# EasyEDA Pro project ProPrj_Hitboard Pro v2.4 顶部 typec_2026-01-22.epro

# Board PCB1
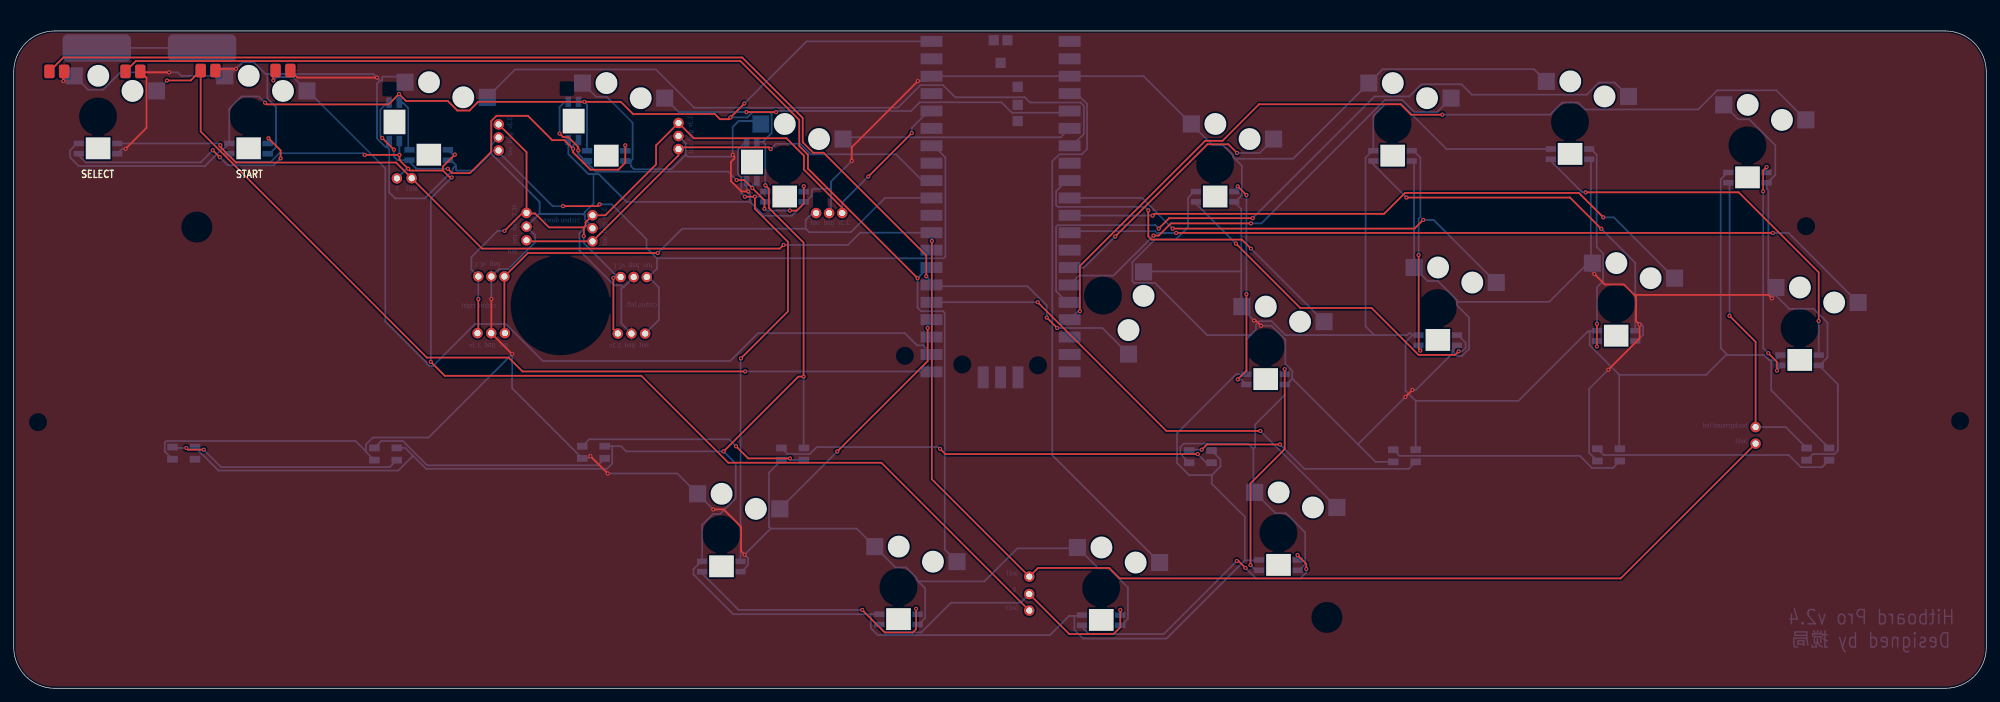
[diagram p0: board, top side]
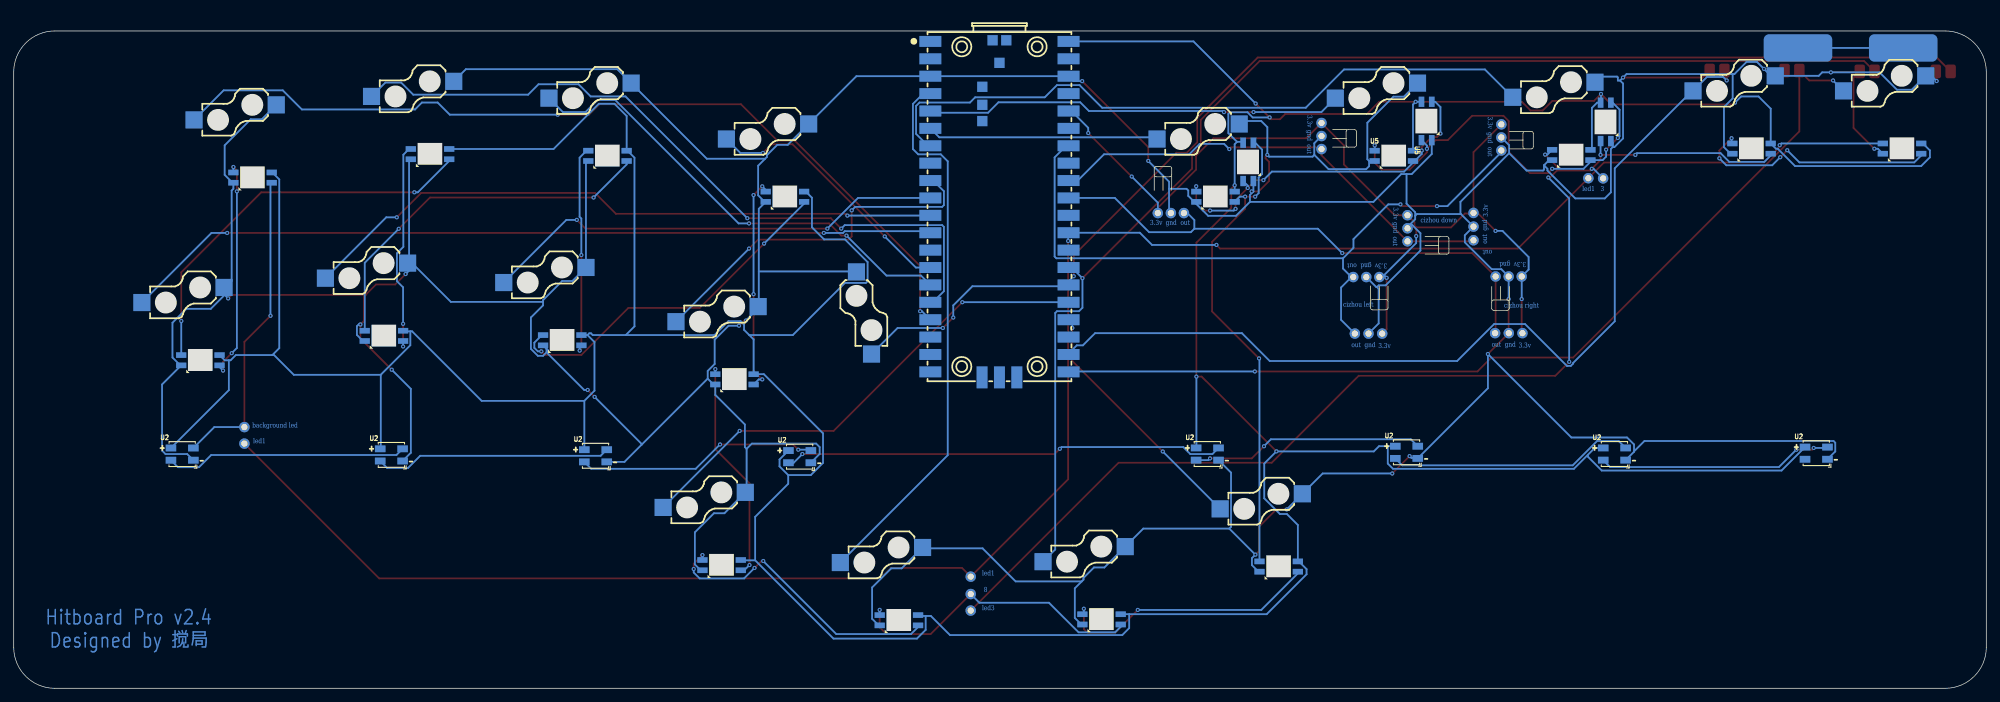
[diagram p1: board, bottom side, seen from below]

Outline 288 x 96 mm; copper layers: Top Layer, Bottom Layer. Coordinates in mm from the lower left corner of the outline.
Outline path: 0,90 arc(1.76,94.24) 6,96 282,96 arc(286.24,94.24) 288,90 288,6 arc(286.24,1.76) 282,0 6,0 arc(1.76,1.76) 0,6 0,90
Stack: Top Layer 0.035mm / Dielectric1 1.51mm FR4 er 4.5 / Bottom Layer 0.035mm

## Design rules (mm)
template: JLCPCB Capability(Two Layers Board)
spacing copperThickness1oz (default): track to track 0.102, other pairs 0.152 to 0.3
spacing copperThickness2oz: track to track 0.203, other pairs 0.152 to 0.3
track width copperThickness1oz (default): min 0.127, default 0.254, max 2.54
track width copperThickness2oz: min 0.203, default 0.254, max 2.54
differential pair differentialPair (default): width min 0.127, default 0.254, max 2.54; gap min 0.152, default 0.152
via viaSize (default): diameter min 0.5, default 0.61, max 10; hole min 0.3, default 0.305, max 6.3

## Placement (name value [footprint] x y rotation side)
NOREF  -  [Pad_e82]  40.39 90.22 0 top
NOREF#2  -  [Pad_e83]  38.23 90.22 0 top
NOREF#3  -  [Pad_e72]  92.43 60.06 180 top
NOREF#4  -  [Pad_e1079]  120.96 69.4 0 top
NOREF#5  -  [Pad_e8275]  148.27 13.77 90 top
NOREF#6  -  [Pad_e123]  70.8 78.55 90 top
NOREF#7  -  [Pad_e81]  27.3 90.22 0 top
NOREF#8  -  [Pad_e7355]  67.72 51.87 0 top
NOREF#9  -  [Pad_e80]  29.46 90.22 0 top
NOREF#10  -  [Pad_e8272]  55.94 74.47 90 top
NOREF#11  -  [Pad_e1081]  117.15 69.4 0 top
NOREF#12  -  [Pad_e56]  7.37 90.09 0 top
NOREF#13  -  [Pad_e117]  97.06 78.75 90 top
NOREF#14  -  [Pad_e8795]  254.32 35.74 90 top
NOREF#15  -  [Pad_e32726]  148.27 16.31 90 top
NOREF#16  -  [Pad_e17942]  148.27 11.35 90 top
NOREF#17  -  [Pad_e24566]  58.1 74.5 90 top
NOREF#18  -  [Pad_e73]  90.52 60.06 180 top
NOREF#19  -  [Pad_e66]  84.51 69.09 90 top
NOREF#20  -  [Pad_e115]  97.06 82.56 90 top
NOREF#21  -  [Pad_e7348]  92.19 51.81 0 top
NOREF#22  -  [Pad_e79]  71.64 60.14 180 top
NOREF#23  -  [Pad_e8276]  254.32 38.15 90 top
NOREF#24  -  [Pad_e71]  88.62 60.06 180 top
NOREF#25  -  [Pad_e121]  70.8 82.36 90 top
NOREF#26  -  [Pad_e7361]  74.87 69.42 270 top
NOREF#27  -  [Pad_e7353]  69.72 51.87 0 top
NOREF#28  -  [Pad_e7360]  74.87 65.43 270 top
NOREF#29  -  [Pad_e77]  67.83 60.14 180 top
NOREF#30  -  [Pad_e44]  16.32 90.09 0 top
NOREF#31  -  [Pad_e65]  84.51 67.18 90 top
NOREF#32  -  [Pad_e64]  84.51 65.28 90 top
NOREF#33  -  [Pad_e16564]  12.13 93.52 0 top
NOREF#34  -  [Pad_e122]  70.8 80.45 90 top
NOREF#35  -  [Pad_e7354]  71.71 51.87 0 top
NOREF#36  -  [Pad_e7349]  88.2 51.81 0 top
NOREF#37  -  [Pad_e47]  18.48 90.09 0 top
NOREF#38  -  [Pad_e1080]  119.05 69.4 0 top
NOREF#39  -  [Pad_e7359]  74.87 67.43 270 top
NOREF#40  -  [Pad_e16566]  27.5 93.52 0 top
NOREF#41  -  [Pad_e116]  97.06 80.66 90 top
NOREF#42  -  [Pad_e78]  69.74 60.14 180 top
NOREF#43  -  [Pad_e67]  5.21 90.09 0 top
NOREF#44  -  [Pad_e7347]  90.2 51.81 0 top
U1  PICO  [COMM-SMD_L51.0-W21.0-P2.54_SC0916]  144.08 70.03 270 bottom
U2  -  [LED-SMD_4P-L3.5-W3.5-TL_WS2812B]  203.05 33.96 180 bottom
U2#2  -  [LED-SMD_4P-L3.5-W3.5-TL_WS2812B]  232.86 34.09 180 bottom
U2#3  -  [LED-SMD_4P-L3.5-W3.5-TL_WS2812B]  173.25 33.83 180 bottom
U2#4  -  [LED-SMD_4P-L3.5-W3.5-TL_WS2812B]  113.73 34.21 180 bottom
U2#5  -  [LED-SMD_4P-L3.5-W3.5-TL_WS2812B]  84.65 34.47 180 bottom
U2#6  -  [LED-SMD_4P-L3.5-W3.5-TL_WS2812B]  54.29 34.21 180 bottom
U2#7  -  [LED-SMD_4P-L3.5-W3.5-TL_WS2812B]  24.83 34.34 180 bottom
U2#8  -  [LED-SMD_4P-L3.5-W3.5-TL_WS2812B]  263.41 34.2 180 bottom
U5  -  [LED-SMD_L3.2-W2.8_YO-WS2812B-3528]  60.59 77.89 180 bottom
U5#2  -  [LED-SMD_L3.2-W2.8_YO-WS2812B-3528]  86.5 77.76 180 bottom
U5#3  -  [LED-SMD_L3.2-W2.8_YO-WS2812B-3528]  112.54 71.79 180 bottom
U5#4  -  [LED-SMD_L3.2-W2.8_YO-WS2812B-3528]  103.31 17.78 180 bottom
U5#5  -  [LED-SMD_L3.2-W2.8_YO-WS2812B-3528]  129.17 10.07 180 bottom
U5#6  -  [LED-SMD_L3.2-W2.8_YO-WS2812B-3528]  158.77 9.94 180 bottom
U5#7  -  [LED-SMD_L3.2-W2.8_YO-WS2812B-3528]  184.65 17.99 180 bottom
U5#8  -  [LED-SMD_L3.2-W2.8_YO-WS2812B-3528]  175.4 71.79 180 bottom
U5#9  -  [LED-SMD_L3.2-W2.8_YO-WS2812B-3528]  182.77 45.12 180 bottom
U5#10  -  [LED-SMD_L3.2-W2.8_YO-WS2812B-3528]  201.31 77.76 180 bottom
U5#11  -  [LED-SMD_L3.2-W2.8_YO-WS2812B-3528]  207.91 50.84 180 bottom
U5#12  -  [LED-SMD_L3.2-W2.8_YO-WS2812B-3528]  227.22 78.01 180 bottom
U5#13  -  [LED-SMD_L3.2-W2.8_YO-WS2812B-3528]  233.95 51.47 180 bottom
U5#14  -  [LED-SMD_L3.2-W2.8_YO-WS2812B-3528]  260.75 47.92 180 bottom
U5#15  -  [LED-SMD_L3.2-W2.8_YO-WS2812B-3528]  253.13 74.59 180 bottom
U5#16  -  [LED-SMD_L3.2-W2.8_YO-WS2812B-3528]  107.75 76.89 90 bottom
U5#17  -  [LED-SMD_L3.2-W2.8_YO-WS2812B-3528]  81.71 82.85 90 bottom
U5#18  -  [LED-SMD_L3.2-W2.8_YO-WS2812B-3528]  55.56 82.73 90 bottom
U5#19  -  [LED-SMD_L3.2-W2.8_YO-WS2812B-3528]  12.31 78.82 180 bottom
U5#20  -  [LED-SMD_L3.2-W2.8_YO-WS2812B-3528]  34.28 78.82 180 bottom
U6  -  [CONN-SMD_HOTPLUGPAKAGE__C9900010116-1]  89.04 87.29 180 bottom
U6#2  -  [CONN-SMD_HOTPLUGPAKAGE__C9900010116-1]  115.08 81.32 180 bottom
U6#3  -  [CONN-SMD_HOTPLUGPAKAGE__C9900010116-1]  105.85 27.31 180 bottom
U6#4  -  [CONN-SMD_HOTPLUGPAKAGE__C9900010116-1]  131.71 19.59 180 bottom
U6#5  -  [CONN-SMD_HOTPLUGPAKAGE__C9900010116-1]  161.31 19.47 180 bottom
U6#6  -  [CONN-SMD_HOTPLUGPAKAGE__C9900010116-1]  187.19 27.51 180 bottom
U6#7  -  [CONN-SMD_HOTPLUGPAKAGE__C9900010116-1]  163.86 54.81 90 bottom
U6#8  -  [CONN-SMD_HOTPLUGPAKAGE__C9900010116-1]  177.94 81.32 180 bottom
U6#9  -  [CONN-SMD_HOTPLUGPAKAGE__C9900010116-1]  185.31 54.65 180 bottom
U6#10  -  [CONN-SMD_HOTPLUGPAKAGE__C9900010116-1]  203.85 87.29 180 bottom
U6#11  -  [CONN-SMD_HOTPLUGPAKAGE__C9900010116-1]  210.45 60.36 180 bottom
U6#12  -  [CONN-SMD_HOTPLUGPAKAGE__C9900010116-1]  229.76 87.54 180 bottom
U6#13  -  [CONN-SMD_HOTPLUGPAKAGE__C9900010116-1]  236.49 61 180 bottom
U6#14  -  [CONN-SMD_HOTPLUGPAKAGE__C9900010116-1]  263.29 57.44 180 bottom
U6#15  -  [CONN-SMD_HOTPLUGPAKAGE__C9900010116-1]  255.67 84.11 180 bottom
U6#16  -  [CONN-SMD_HOTPLUGPAKAGE__C9900010116-1]  14.85 88.35 180 bottom
U6#17  -  [CONN-SMD_HOTPLUGPAKAGE__C9900010116-1]  36.82 88.35 180 bottom
U6#18  -  [CONN-SMD_HOTPLUGPAKAGE__C9900010116-1]  63.13 87.41 180 bottom

## Footprints (pads in the part's own frame, mm; a bottom-side part is the same pattern mirrored in y, then rotated)
COMM-SMD_L51.0-W21.0-P2.54_SC0916
  rect 1.6x3.2 smd: 1(-24.445,-10.088) 2(-21.905,-10.088) 3(-19.365,-10.088) 4(-16.825,-10.088) 5(-14.285,-10.088) 6(-11.745,-10.088) 7(-9.205,-10.088) 8(-6.665,-10.088) 9(-4.125,-10.088) 10(-1.585,-10.088) 11(0.955,-10.088) 12(3.495,-10.088) 13(6.035,-10.088) 14(8.575,-10.088) 15(11.115,-10.088) 16(13.655,-10.088) 17(16.195,-10.088) 18(18.735,-10.088) 19(21.275,-10.088) 20(23.815,-10.088) 21(23.815,10.088) 22(21.275,10.088) 23(18.735,10.088) 24(16.195,10.088) 25(13.655,10.088) 26(11.115,10.088) 27(8.575,10.088) 28(6.035,10.088) 29(3.495,10.088) 30(0.955,10.088) 31(-1.585,10.088) 32(-4.125,10.088) 33(-6.665,10.088) 34(-9.205,10.088) 35(-11.745,10.088) 36(-14.285,10.088) 37(-16.825,10.088) 38(-19.365,10.088) 39(-21.905,10.088) 40(-24.445,10.088)
  rect 3.2x1.6 smd: 41(24.615,-2.54) 42(24.615,0) 43(24.615,2.54)
  rect 1.5x1.5 smd: TP1(-21.315,0) TP2(-24.615,1) TP3(-24.615,-1) TP4(-17.815,-2.5) TP5(-15.188,-2.5) TP6(-12.815,-2.5)
CONN-SMD_HOTPLUGPAKAGE__C9900010116-1
  rect 2.5x2.5 smd: 1(-6,-1.1) 2(6,1.1)
LED-SMD_4P-L3.5-W3.5-TL_WS2812B
  rect 1.545x0.997 smd: 1(-1.637,0.89) 2(-1.637,-0.89) 3(1.637,-0.89) 4(1.637,0.89)
LED-SMD_L3.2-W2.8_YO-WS2812B-3528
  rect 1.5x0.82 smd: 1(2.8,0.75) 2(2.8,-0.75) 3(-2.8,-0.75) 4(-2.8,0.75)
Pad_e44
  rrect 1.524x2 smd: 1(0,0)
Pad_e47
  rrect 1.524x2 smd: 1(0,0)
Pad_e56
  rrect 1.524x2 smd: 1(0,0)
Pad_e64
  round 1.524 hole 0.914: 3(0,0)
Pad_e65
  round 1.524 hole 0.914: 2(0,0)
Pad_e66
  round 1.524 hole 0.914: 1(0,0)
Pad_e67
  rrect 1.524x2 smd: 1(0,0)
Pad_e71
  round 1.524 hole 0.914: 1(0,0)
Pad_e72
  round 1.524 hole 0.914: 3(0,0)
Pad_e73
  round 1.524 hole 0.914: 2(0,0)
Pad_e77
  round 1.524 hole 0.914: 1(0,0)
Pad_e78
  round 1.524 hole 0.914: 2(0,0)
Pad_e79
  round 1.524 hole 0.914: 3(0,0)
Pad_e80
  rrect 1.524x2 smd: 1(0,0)
Pad_e81
  rrect 1.524x2 smd: 1(0,0)
Pad_e82
  rrect 1.524x2 smd: 1(0,0)
Pad_e83
  rrect 1.524x2 smd: 1(0,0)
Pad_e115
  round 1.524 hole 0.914: 1(0,0)
Pad_e116
  round 1.524 hole 0.914: 2(0,0)
Pad_e117
  round 1.524 hole 0.914: 3(0,0)
Pad_e121
  round 1.524 hole 0.914: 1(0,0)
Pad_e122
  round 1.524 hole 0.914: 2(0,0)
Pad_e123
  round 1.524 hole 0.914: 3(0,0)
Pad_e1079
  round 1.524 hole 0.914: 1(0,0)
Pad_e1080
  round 1.524 hole 0.914: 2(0,0)
Pad_e1081
  round 1.524 hole 0.914: 3(0,0)
Pad_e7347
  round 1.524 hole 0.914: 2(0,0)
Pad_e7348
  round 1.524 hole 0.914: 3(0,0)
Pad_e7349
  round 1.524 hole 0.914: 1(0,0)
Pad_e7353
  round 1.524 hole 0.914: 2(0,0)
Pad_e7354
  round 1.524 hole 0.914: 3(0,0)
Pad_e7355
  round 1.524 hole 0.914: 1(0,0)
Pad_e7359
  round 1.524 hole 0.914: 2(0,0)
Pad_e7360
  round 1.524 hole 0.914: 3(0,0)
Pad_e7361
  round 1.524 hole 0.914: 1(0,0)
Pad_e8272
  round 1.524 hole 0.914: 2(0,0)
Pad_e8275
  round 1.524 hole 0.914: 2(0,0)
Pad_e8276
  round 1.524 hole 0.914: 2(0,0)
Pad_e8795
  round 1.524 hole 0.914: 2(0,0)
Pad_e16564
  rrect 10x4 smd far side: 1(0,0)
Pad_e16566
  rrect 10x4 smd far side: 1(0,0)
Pad_e17942
  round 1.524 hole 0.914: 2(0,0)
Pad_e24566
  round 1.524 hole 0.914: 2(0,0)
Pad_e32726
  round 1.524 hole 0.914: 2(0,0)

## Nets
3.3V: NOREF#4.1 NOREF#8.1 NOREF#19.1 NOREF#20.1 NOREF#24.1 NOREF#25.1 NOREF#26.1 NOREF#29.1 NOREF#36.1 U1.36
GND: NOREF.1 NOREF#9.1 NOREF#12.1 NOREF#18.2 NOREF#27.2 NOREF#31.2 NOREF#34.2 NOREF#37.1 NOREF#38.2 NOREF#39.2 NOREF#41.2 NOREF#42.2 NOREF#44.2 U1.3 U1.38 U2.3 U2#2.3 U2#3.3 U2#4.3 U2#5.3 U2#6.3 U2#7.3 U2#8.3 U5.3 U5#2.3 U5#3.3 U5#4.3 U5#5.3 U5#6.3 U5#7.3 U5#8.3 U5#9.3 U5#10.3 U5#11.3 U5#12.3 U5#13.3 U5#14.3 U5#15.3 U5#16.3 U5#17.3 U5#18.3 U5#19.3 U5#20.3 U6.2 U6#2.2 U6#3.2 U6#4.2 U6#5.2 U6#6.2 U6#7.2 U6#8.2 U6#9.2 U6#10.2 U6#11.2 U6#12.2 U6#13.2 U6#14.2 U6#15.2 U6#16.2 U6#17.2 U6#18.2
VCC: U1.40 U2.1 U2#2.1 U2#3.1 U2#4.1 U2#5.1 U2#6.1 U2#7.1 U2#8.1 U5.1 U5#2.1 U5#3.1 U5#4.1 U5#5.1 U5#6.1 U5#7.1 U5#8.1 U5#9.1 U5#10.1 U5#11.1 U5#12.1 U5#13.1 U5#14.1 U5#15.1 U5#16.1 U5#17.1 U5#18.1 U5#19.1 U5#20.1
2: U5#19.2 U5#20.4
3: NOREF#10.2 NOREF#16.2 U5.4 U5#18.4 U5#20.2
4: U5.2 U5#2.4 U5#17.4 U5#18.2
5: U5#2.2 U5#3.4 U5#16.4 U5#17.2
6: U5#3.2 U5#4.4 U5#16.2
7: U5#4.2 U5#5.4
8: NOREF#5.2 U5#5.2 U5#6.4
9: U5#6.2 U5#7.4
10: U5#7.2 U5#9.4
11: U5#8.4 U5#9.2
12: U5#8.2 U5#11.4
13: U5#10.4 U5#11.2
14: U5#10.2 U5#13.4
15: U5#12.4 U5#13.2
16: U5#12.2 U5#14.4
17: U5#14.2 U5#15.4
18: NOREF#23.2 U2#8.4 U5#15.2
19: U2#2.4 U2#8.2
20: U2.4 U2#2.2
21: U2.2 U2#3.4
22: U2#3.2 U2#4.4
23: U2#4.2 U2#5.4
24: U2#5.2 U2#6.4
25: U2#6.2 U2#7.4
26: U2#7.2
A: U1.9 U6#9.1
B: U1.10 U6#11.1
CAPTURE: NOREF#30.1 U1.27 U6#4.1
CI_DOWN: NOREF#13.3 NOREF#28.3 NOREF#32.3 U1.32
CI_LEFT: NOREF#3.3 NOREF#6.3 NOREF#21.3 U1.34
CI_RIGHT: NOREF#11.3 NOREF#22.3 NOREF#35.3 U1.31
DOWN: U1.5 U6.1
GUDING1: NOREF#33.1 NOREF#40.1
HOME: NOREF#43.1 U1.26 U6#7.1
L3: U1.24 U6#3.1
LB: U1.17 U6#15.1
LED1: NOREF#14.2 NOREF#15.2 NOREF#17.2 U1.29 U5#19.4
LEFT: U1.7 U6#18.1
LT: U1.12 U6#14.1
R3: U1.25 U6#6.1
RB: U1.16 U6#12.1
RIGHT: U1.6 U6#2.1
RT: U1.11 U6#13.1
SELECT: NOREF#7.1 U1.21 U6#16.1
START: NOREF#2.1 U1.22 U6#17.1
UP: U1.4 U6#5.1
X: U1.14 U6#8.1
Y: U1.15 U6#10.1

Pads without a net: U1 1 2 8 13 18 19 20 23 28 30 33 35 37 39 41 42 43 TP1 TP2 TP3 TP4 TP5 TP6

## Via types
v1: diameter 0.61, hole 0.305, Top Layer to Bottom Layer, 134 vias

## Routing (per net, layer and track width the routed paths; a pad name or vN(x,y) marks a point on that pad's centre or on a via; arc(x,y) is an arc through that point)
3.3V: length 138.6
  Top Layer w0.254: 74.95,69.34 76.12,69.34 78.16,67.31 83.23,67.31 ; 74.95,69.34 NOREF#26.1 74.87,78.29 NOREF#25.1 ; 74.95,69.34 74.19,69.34 v1(71.65,66.8) ; NOREF#4.1 120.96,70.17 115.37,75.75 115.37,77.79 112.83,80.33 99.3,80.33 NOREF#20.1 93.79,79.29 93.79,76.5 86.37,69.09 NOREF#19.1 83.49,68.07 83.49,67.56 83.23,67.31 ; NOREF#36.1 87.55,52.45 v1(87.55,59.94) ; 83.23,67.31 v1(83.23,66.04) ; v1(67.83,56.84) 67.83,51.98 NOREF#8.1 ; v1(124.77,74.74) v1(131.12,81.09)
  Bottom Layer w0.254: NOREF#24.1 88.48,60.2 88.06,60.2 ; 88.06,60.2 83.23,65.02 v1(83.23,66.04) ; 88.06,60.2 87.81,60.2 v1(87.55,59.94) ; v1(131.12,81.09) 131.12,81.85 133.58,84.31 U1.36 ; v1(124.77,74.74) 120.96,70.93 NOREF#4.1 ; v1(67.83,56.84) NOREF#29.1 66.82,61.15 66.82,62.99 70.63,66.8 v1(71.65,66.8)
GND: length 1003.4
  Top Layer w0.254: v1(132.01,88.67) 122.35,79.02 v1(122.35,77.02) ; v1(16.34,78.8) 19.39,81.85 19.39,89.19 18.62,89.96 ; 236.62,57.45 236.88,57.2 236.88,53.64 v1(237.38,53.13) 237.38,51.1 v1(232.81,46.53) ; 236.62,57.45 235.1,58.98 232.3,58.98 v1(230.78,60.5) ; 236.62,57.45 256.18,57.45 v1(256.69,56.94) ; v1(22.69,89.96) 18.62,89.96 ; 18.62,89.96 NOREF#37.1 ; v1(107.26,72.57) 106.24,72.57 104.72,74.09 104.72,76.88 105.22,77.39 105.22,77.65 v1(104.97,77.9) ; NOREF.1 41.41,89.19 v1(53.04,89.19) ; v1(32.46,90.46) 29.7,90.46 NOREF#9.1 ; v1(102.14,26.12) 103.66,26.12 106.2,23.58 106.2,20.03 v1(106.71,19.52) ; v1(69.74,56.84) 69.74,51.89 NOREF#27.2 v1(72.77,48.82) ; NOREF#12.1 7.25,89.98 v1(7.25,88.69) ; v1(182.1,52.95) 181.34,53.71 v1(181.09,53.71) ; v1(84.2,33.91) v1(86.74,31.37) ; v1(203.18,42.56) v1(204.2,43.57)
  Bottom Layer w0.254: 179.22,60.88 165.03,60.88 U6#7.2 ; 179.22,60.88 179.22,55.84 U6#9.2 179.31,55.49 v1(181.09,53.71) ; 179.22,60.88 179.22,70.03 U5#8.3 178.35,71.04 179.31,72 179.31,76.32 178.29,77.34 ; 107.51,71.04 109.54,69.01 113.61,69.01 115.38,70.79 115.38,71.04 ; 107.51,71.04 107.51,72.06 107,72.57 ; 107.51,71.04 89.48,71.04 85.41,75.11 84.65,75.11 ; 181,34.97 181.25,35.23 181.25,38.53 185.57,42.85 U5#9.3 185.82,44.37 186.67,45.22 ; 181,34.97 180.23,35.74 170.84,35.74 170.33,35.23 170.33,34.23 U2#3.3 ; 181,34.97 181,28.8 U6#6.2 184.23,25.57 185.76,25.57 188.55,22.77 188.55,18.09 187.7,17.24 U5#7.3 ; U2#2.3 230.02,34.4 230.02,43.74 v1(232.81,46.53) ; 210.21,49.58 U5#11.3 ; 210.21,49.58 210.04,49.41 210.04,48.91 204.71,43.57 v1(204.2,43.57) ; 210.21,49.58 210.21,49.07 210.71,48.56 211.48,48.56 212.49,49.58 212.49,54.15 210.71,55.93 210.71,56.44 ; NOREF#34.2 69.66,79.31 69.66,78.15 ; v1(132.01,88.67) 133.28,88.67 U1.38 U1.3 164.97,89.39 U6#8.2 174.99,79.37 176.51,79.37 178.04,77.84 178.04,77.59 178.29,77.34 ; 64.58,76.38 64.41,76.2 64.4,76.2 64.07,75.87 64.07,75.61 60.01,71.55 55.69,71.55 54.81,72.43 54.81,78.78 54.56,79.03 ; 64.58,76.38 64.58,75.74 64.71,75.62 67.13,75.62 69.66,78.15 ; 64.58,76.38 63.82,77.14 U5.3 ; 119.29,72.95 116.77,72.95 116.51,72.69 116.51,71.92 115.64,71.04 115.38,71.04 ; 119.29,72.95 119.32,72.97 119.32,73.99 v1(122.35,77.02) ; 119.29,72.95 119.32,72.95 119.32,69.67 NOREF#38.2 ; v1(86.74,31.37) 96.89,31.37 U6#3.2 v1(102.14,26.12) ; U6#15.2 251.77,83.11 253.39,83.11 257.2,79.3 257.2,74.98 255.93,73.71 ; 230.27,62.02 230.42,62.02 U6#13.2 ; 230.27,62.02 230.27,61.01 v1(230.78,60.5) ; 230.27,62.02 230.02,62.02 ; 210.71,56.44 210.71,56.69 207.92,59.48 206.43,59.48 U6#11.2 204.45,76.67 U5#10.3 ; 210.71,56.44 224.18,56.44 229.76,62.02 230.02,62.02 ; 90.11,77.01 90.11,76.25 90.54,75.82 96.03,75.82 98.11,77.9 ; 90.11,77.01 U5#2.3 ; 90.11,77.01 90.37,77.26 90.37,82.6 86.56,86.41 85.02,86.41 U6.2 ; U5#5.3 132.12,9.32 133.08,10.28 133.08,14.6 132.06,15.61 ; 69.66,78.15 76.78,71.04 76.78,69.26 ; v1(69.74,56.84) NOREF#42.2 70.81,61.21 72.21,61.21 76.14,65.14 76.14,66.16 NOREF#39.2 76.7,69.26 76.78,69.26 ; 107,72.57 107,74.08 ; 107,72.57 v1(107.26,72.57) ; 82.93,33.66 U2#5.3 ; 82.93,33.66 72.77,43.82 v1(72.77,48.82) 60.57,36.63 52.45,36.63 51.43,35.61 51.43,34.6 ; 82.93,33.66 83.94,33.66 v1(84.2,33.91) ; 257.2,58.47 256.18,59.48 256.18,72.69 255.93,72.95 255.93,73.71 ; 257.2,58.47 257.2,57.45 ; 257.2,58.47 U6#14.2 ; 51.43,34.6 51.43,34.55 U2#6.3 ; 51.43,34.6 49.91,36.12 22.31,36.12 22.05,35.87 22.05,34.59 U2#7.3 ; 178.29,77.34 186.8,77.34 U6#10.2 199.88,90.42 221.98,90.42 U6#12.2 ; 37.03,89.7 36.78,89.7 35,91.48 33.48,91.48 v1(32.46,90.46) 31.45,89.45 U6#17.2 24.47,89.45 23.96,89.96 v1(22.69,89.96) 15.58,89.96 13.04,87.42 10.88,87.42 U6#16.2 8.01,89.45 v1(7.25,88.69) ; 37.03,89.7 52.53,89.7 v1(53.04,89.19) 53.47,88.76 ; 37.03,89.7 37.03,86.15 38.3,84.88 38.3,79.03 37.34,78.07 U5#20.3 ; 53.47,88.76 53.04,88.33 53.04,80.3 54.31,79.03 54.56,79.03 ; 53.47,88.76 53.8,88.76 53.8,89.22 53.91,89.33 56.31,89.33 57.13,88.51 ; 257.2,57.45 v1(256.69,56.94) ; 257.2,57.45 259.23,55.42 262.78,55.42 264.82,53.39 264.82,48.31 263.67,47.17 U5#14.3 266.34,44.37 266.34,34.72 265.83,34.21 262.67,34.21 U2#8.3 ; 83.38,69.01 83.38,69.52 84.65,70.79 84.65,75.11 ; 83.38,69.01 83.13,69.26 76.78,69.26 ; 83.38,69.01 83.38,68.5 84.14,67.74 ; 98.11,77.9 98.37,77.65 104.72,77.65 v1(104.97,77.9) 104.97,81.96 105.86,82.85 108.64,82.85 U6#2.2 ; 98.11,77.9 98.11,79.6 NOREF#41.2 ; 186.67,45.22 196.33,35.57 ; 186.67,45.22 186.67,46.35 185.66,47.36 185.66,50.92 183.63,52.95 v1(182.1,52.95) ; U5#17.3 80.96,78.03 83.89,75.11 84.65,75.11 ; 54.56,79.03 54.56,79.67 U5#18.3 ; U5#4.3 106.26,17.03 107.22,17.99 107.22,19.01 v1(106.71,19.52) 110.52,23.33 ; U5#19.3 15.83,78.8 v1(16.34,78.8) ; 84.14,67.74 83.89,67.74 82.62,66.47 82.62,63.93 87.7,58.85 88.71,58.85 88.97,58.6 ; 84.14,67.74 84.51,67.38 NOREF#31.2 ; 110.52,23.33 110.27,23.58 110.27,31.5 U2#4.3 ; 110.52,23.33 123.08,23.33 U6#4.2 128.76,17.65 130.29,17.65 131.81,16.12 131.81,15.87 132.06,15.61 ; 196.33,35.57 196.33,35.7 v1(203.18,42.56) ; 196.33,35.57 198.83,33.07 U2.3 ; 132.06,15.61 141.72,15.61 146.54,20.44 155.18,20.44 U6#5.2 158.35,17.52 159.88,17.52 162.67,14.73 162.67,10.15 161.71,9.19 U5#6.3 ; 115.38,71.04 U5#3.3 ; 255.93,73.71 U5#15.3 ; NOREF#18.2 89.06,58.6 88.97,58.6 ; U5#12.3 230.27,77.01 230.27,62.28 230.02,62.02 ; 88.97,58.6 88.71,58.34 88.71,53.29 NOREF#44.2 ; U5#13.3 236.88,50.85 237.13,50.85 237.89,51.61 237.89,52.88 237.64,53.13 v1(237.38,53.13)
VCC: length 760.2
  Top Layer w0.254: v1(103.64,34.6) 114.56,45.52 v1(115.33,45.52) 115.33,65.08 110.25,70.16 110.25,72.95 v1(109.74,73.46) ; v1(36.7,85.53) 36.95,85.27 54.73,85.27 v1(56.26,86.8) 57.27,85.78 63.37,85.78 64.77,84.38 66.54,84.38 67.81,85.65 v1(83.31,85.65) 88.64,85.65 90.42,83.88 102.36,83.88 103.12,83.11 104.39,83.11 v1(104.64,83.37) v1(106.68,85.4)
  Bottom Layer w0.254: U5#19.1 9.25,79.57 8.24,78.56 8.24,77.54 9.51,76.27 27.92,76.27 30.46,78.81 30.71,78.81 U5#20.1 31.48,84.65 33.25,86.43 35.79,86.43 v1(36.7,85.53) ; 180.6,51.59 181.37,52.35 181.37,53.11 181.87,53.62 183.65,53.62 185.68,51.59 198.64,51.59 ; 180.6,51.59 174.25,51.59 166.63,59.21 163.59,59.21 163.33,59.46 163.33,62.25 166.63,65.56 169.68,65.56 171.46,67.33 171.46,71.65 172.22,72.41 172.47,72.41 U5#8.1 ; 180.6,51.59 179.97,50.95 U5#9.1 178.48,45.87 169.84,37.24 169.84,32.92 171.62,31.14 174.92,31.14 ; U5#3.1 v1(109.74,73.46) 109.74,79.46 109.39,79.81 ; v1(56.26,86.8) 56.26,85.58 U5#18.1 56.82,85.53 57.58,84.77 57.58,78.85 U5.1 ; 100.51,18.68 U5#4.1 ; 100.51,18.68 99.24,17.41 99.24,16.65 105.07,10.82 125.14,10.82 ; 100.51,18.68 100.51,23.85 102.12,25.46 103.13,25.46 105.42,27.74 105.42,32.82 v1(103.64,34.6) 89.42,34.6 88.66,35.36 87.39,35.36 ; 58.17,34.09 60.21,32.06 86.62,32.06 87.39,32.82 87.39,35.36 ; 58.17,34.09 58.17,33.84 56.14,31.81 29.89,31.81 U2#7.1 ; 58.17,34.09 57.16,35.1 U2#6.1 ; 204.22,51.59 203.21,50.57 203.21,43.46 204.69,41.98 ; 204.22,51.59 U5#11.1 ; 204.22,51.59 203.97,51.84 203.72,51.84 203.46,51.59 198.64,51.59 ; 109.39,79.81 110.66,81.08 110.66,83.88 110.4,84.13 107.86,84.13 107.1,83.37 v1(104.64,83.37) ; 109.39,79.81 108.63,79.81 U5#16.1 ; 174.92,31.14 176.19,32.41 176.19,33.42 U2#3.1 ; 174.92,31.14 174.92,29.87 179.75,25.04 179.75,18.69 ; U5#12.1 209.18,78.76 202.57,85.37 200.29,85.37 198.51,83.59 U5#10.1 198.38,78.51 197.37,77.49 197.37,52.86 198.64,51.59 ; 234.41,45.79 230.09,50.1 230.09,52.14 ; 234.41,45.79 234.41,35.06 U2#2.1 ; 234.41,45.79 247.11,45.79 249.99,48.67 250.24,48.67 ; U5#13.1 231.06,52.14 230.09,52.14 ; 250.24,48.67 255.57,48.67 256.34,47.9 256.59,47.9 ; 250.24,48.67 249.22,49.68 249.22,74.32 250.24,75.34 U5#15.1 ; 125.14,10.82 U5#5.1 ; 125.14,10.82 125.14,8.79 126.15,7.77 151.3,7.77 154.09,10.56 154.85,10.56 ; 204.69,41.98 219.68,41.98 229.84,52.14 230.09,52.14 ; 204.69,41.98 204.69,34.85 ; 256.59,47.9 257.18,47.9 U5#14.1 ; 256.59,47.9 256.59,43.54 U2#8.1 ; U1.40 115.75,94.47 v1(106.68,85.4) ; 87.39,35.36 86.29,35.36 ; U2#4.1 115.33,35.15 v1(115.33,45.52) ; U5#17.1 v1(83.31,85.65) 83.7,85.26 U5#2.1 ; 179.75,18.69 181.8,18.69 U5#7.1 ; 179.75,18.69 168.32,7.26 156.12,7.26 154.85,8.53 154.85,10.56 ; U5#6.1 155.84,10.56 154.85,10.56
2: length 36.7
  Top Layer w0.254: v1(29.06,78.58) v1(30.08,77.56) ; v1(37.19,80.33) 38.97,78.56 v1(38.97,77.4)
  Bottom Layer w0.254: v1(30.08,77.56) 31.26,76.39 37.95,76.39 v1(38.97,77.4) ; v1(29.06,78.58) 27.29,76.8 10.52,76.8 9.51,77.82 U5#19.2 ; U5#20.4 37.19,79.69 v1(37.19,80.33)
3: length 174.8
  Top Layer w0.254: v1(51.25,77.9) v1(56.33,77.9) 56.33,77.14 v1(57.6,75.87) 57.85,75.62 62.68,75.62 ; 62.68,75.62 63.69,74.6 v1(63.95,74.6) ; 62.68,75.62 62.68,76.21 v1(64.41,77.94) ; NOREF#16.2 126.68,32.94 104.33,32.94 91.63,45.64 62.93,45.64 v1(60.9,47.68)
  Bottom Layer w0.254: U5#18.4 56.33,79.92 v1(56.33,77.9) ; v1(60.9,47.68) 60.9,71.55 v1(63.95,74.6) ; v1(57.6,75.87) 57.34,75.87 NOREF#10.2 ; U5.4 64.09,77.94 v1(64.41,77.94) ; v1(51.25,77.9) 50.99,78.16 38.8,78.16 37.53,76.89 32.41,76.89 31.48,77.82 U5#20.2
4: length 59.3
  Top Layer w0.254: v1(55.51,78.66) v1(53.8,80.37) ; v1(63.38,75.87) 64.01,75.23 66.61,75.23 69.73,78.35 69.73,82.85 70.49,83.61 75.07,83.61 78.62,80.05 80.4,80.05 v1(81.67,78.78) 81.67,78.28 84.21,75.74 88.27,75.74 89.29,76.75 v1(89.29,79.29)
  Bottom Layer w0.254: U5#17.4 81.67,79.26 v1(81.67,78.78) ; v1(63.38,75.87) 58.81,75.87 57.79,76.88 U5.2 56.02,77.14 55.51,77.65 v1(55.51,78.66) ; U5#2.4 89.29,78.52 v1(89.29,79.29) ; v1(53.8,80.37) 53.54,80.63 53.54,84.51 54.56,85.53 U5#18.2
5: length 52.3
  Top Layer w0.254: v1(109.61,70.02) 109.61,71.29 v1(107.83,73.07) 106.69,74.22 v1(105.55,74.22) ; v1(79.69,81.02) 80.2,80.51 80.96,80.51 82.43,79.04 v1(82.43,78.53) ; v1(115.36,73.32) 115.36,70.78 114.34,69.77 v1(113.33,69.77)
  Bottom Layer w0.254: v1(82.43,78.53) 82.43,78.03 83.45,77.01 U5#2.2 83.7,76.76 85,75.46 104.3,75.46 v1(105.55,74.22) ; v1(113.33,69.77) 109.86,69.77 v1(109.61,70.02) ; U5#3.4 115.36,72.56 v1(115.36,73.32) ; U5#17.2 80.46,85.65 79.69,84.89 v1(79.69,81.02) ; U5#16.4 107.83,73.42 v1(107.83,73.07)
6: length 70.4
  Top Layer w0.254: v1(106.18,48.18) 113.04,55.04 113.04,65.2 108.21,70.03 v1(108.21,71.8) v1(106.75,71.8)
  Bottom Layer w0.254: v1(108.21,71.8) 108.98,71.8 U5#3.2 ; U5#16.2 106.75,79.69 105.73,78.67 105.73,75.11 106.24,74.6 106.24,72.31 v1(106.75,71.8) ; U5#4.4 106.11,48.11 v1(106.18,48.18)
7: length 39.1
  Top Layer w0.254: v1(123.88,11.44) 127.18,8.14 131.25,8.14 131.76,8.65 v1(131.76,11.62)
  Bottom Layer w0.254: v1(131.76,11.62) 131.76,11.04 U5#5.4 ; v1(123.88,11.44) 105.85,11.44 100.51,16.78 U5#4.2
8: length 44.3
  Top Layer w0.254: v1(161.56,11.45) 161.56,8.91 160.58,7.92 154.12,7.92 NOREF#5.2
  Bottom Layer w0.254: v1(161.56,11.45) U5#6.4 ; U5#5.2 126.37,9 127.19,8.18 132.53,8.18 136.84,12.5 147,12.5 NOREF#5.2
9: length 43
  Top Layer w0.254: v1(178.57,18.59) 178.83,18.59 v1(179.84,17.57) ; v1(188.72,17.42) 188.72,18.19 v1(187.44,19.46)
  Bottom Layer w0.254: v1(188.72,17.42) 188.72,16.92 187.85,16.05 181.37,16.05 v1(179.84,17.57) ; v1(187.44,19.46) U5#7.4 ; U5#6.2 155.97,8.94 156.98,7.92 167.9,7.92 v1(178.57,18.59)
10: length 33
  Top Layer w0.254: v1(180.58,18) 180.58,29.94 185.57,34.93 v1(185.57,46.62)
  Bottom Layer w0.254: v1(185.57,46.62) U5#9.4 ; v1(180.58,18) 181.34,17.24 U5#7.2
11: length 31.8
  Top Layer w0.254: v1(179.98,57.56) 179.98,46.38 v1(178.71,45.11) ; v1(178.71,73.3) v1(179.98,72.03)
  Bottom Layer w0.254: U5#9.2 179.23,45.11 v1(178.71,45.11) ; U5#8.4 178.2,72.8 v1(178.71,73.3) ; v1(179.98,72.03) v1(179.98,57.56)
12: length 51.7
  Top Layer w0.254: v1(210.97,49.21) 210.45,48.69 205.11,48.69 198.26,55.55 187.84,55.55 v1(178.44,64.95)
  Bottom Layer w0.254: v1(210.97,49.21) 211.48,49.21 211.98,49.72 211.98,50.48 211.09,51.38 210.92,51.38 U5#11.4 ; U5#8.2 172.6,70.79 v1(178.44,64.95)
13: length 30.9
  Top Layer w0.254: v1(205.13,63.27) 205.13,49.57 v1(205.37,49.32)
  Bottom Layer w0.254: U5#11.2 205.37,49.83 v1(205.37,49.32) ; U5#10.4 204.36,78.51 205.38,77.49 205.38,68.86 205.13,68.6 v1(205.13,63.27)
14: length 54.6
  Top Layer w0.254: v1(203.34,71.68) 227.21,71.68 v1(231.78,67.1)
  Bottom Layer w0.254: U5#13.4 236.75,62.14 v1(231.78,67.1) ; v1(203.34,71.68) 198.51,76.5 U5#10.2
15: length 31
  Top Layer w0.254: v1(231.15,53.23) v1(231.15,49.92)
  Bottom Layer w0.254: U5#12.4 230.27,78.76 231.11,77.93 231.11,64.46 232.05,63.52 232.05,59.46 231.15,58.56 v1(231.15,53.23) ; v1(231.15,49.92) U5#13.2
16: length 58.2
  Top Layer w0.254: v1(263.53,53.64) 263.53,60.75 251.85,72.44 v1(229.5,72.44)
  Bottom Layer w0.254: U5#14.4 263.53,48.68 v1(263.53,53.64) ; U5#12.2 224.42,77.01 228.99,72.44 v1(229.5,72.44)
17: length 32.5
  Top Layer w0.254: v1(257.44,46.4) 257.44,47.67 v1(256.17,48.94) ; v1(255.42,72.58) 255.42,75.63 v1(255.93,76.13)
  Bottom Layer w0.254: v1(257.44,46.4) 257.95,46.91 U5#14.2 ; v1(255.42,72.58) 255.42,49.69 v1(256.17,48.94) ; v1(255.93,76.13) U5#15.4
18: length 46.1
  Top Layer w0.254: NOREF#23.2 254.32,50.6 v1(250.51,54.41)
  Bottom Layer w0.254: v1(250.51,54.41) 250.51,73.65 U5#15.2 ; NOREF#23.2 258.71,38.15 U2#8.4
19: length 35.4
  Bottom Layer w0.254: U2#8.2 264.03,32.29 260.94,32.29 259.16,34.07 232.12,34.07 U2#2.4
20: length 34.6
  Bottom Layer w0.254: U2#2.2 233.48,32.18 230.43,32.18 228.65,33.96 202.31,33.96 U2.4
21: length 35.3
  Top Layer w0.254: v1(173.45,34.85) 174.21,35.61 v1(184.88,35.61)
  Bottom Layer w0.254: 204.69,33.07 203.67,32.05 188.43,32.05 v1(184.88,35.61) ; U2#3.4 171.74,34.85 v1(173.45,34.85)
22: length 64.5
  Top Layer w0.254: v1(172.86,34.21) 136.03,34.21 v1(135.26,34.97)
  Bottom Layer w0.254: v1(135.26,34.97) 135.01,35.23 117.23,35.23 116.21,34.21 112.98,34.21 U2#4.4 ; U2#3.2 174.13,32.94 v1(172.86,34.21)
23: length 34
  Top Layer w0.254: v1(113.34,33.58) 107.24,33.58 v1(105.46,35.36)
  Bottom Layer w0.254: U2#4.2 113.59,33.32 v1(113.34,33.58) ; U2#5.4 84.02,36.37 104.45,36.37 v1(105.46,35.36)
24: length 35.9
  Bottom Layer w0.254: U2#6.4 53.67,36.12 56.82,36.12 60.38,32.56 85.27,32.56 U2#5.2
25: length 34.4
  Top Layer w0.254: v1(25.2,35.1) 25.45,34.85 v1(27.74,34.85)
  Bottom Layer w0.254: v1(27.74,34.85) 30.28,32.31 54.91,32.31 U2#6.2 ; U2#7.4 23.32,35.1 v1(25.2,35.1)
A: length 53.1
  Top Layer w0.254: v1(180.64,64.21) 179.32,65.53 166.12,65.53 165.65,65.99 v1(165.65,69.8)
  Bottom Layer w0.254: v1(165.65,69.8) 165.15,70.31 152.45,70.31 152.19,70.56 152.19,72.6 153.75,74.15 U1.9 ; 191.31,53.55 v1(180.64,64.21)
B: length 68.5
  Top Layer w0.254: v1(169.21,67.14) 204.52,67.14 v1(205.79,68.41)
  Bottom Layer w0.254: U1.10 164.73,71.61 v1(169.21,67.14) ; v1(205.79,68.41) 207.31,68.41 U6#11.1
CAPTURE: length 181.2
  Top Layer w0.254: NOREF#30.1 17.84,91.62 106.08,91.62 114.69,83.01 114.69,79.2 115.96,77.93 115.96,75.9 v1(131.96,59.9)
  Bottom Layer w0.254: 137.71,18.49 135.94,20.27 135.94,54.82 135.68,55.07 132.47,55.07 131.96,55.58 v1(131.96,59.9) 133.52,61.45 U1.27
CI_DOWN: length 68.1
  Top Layer w0.254: v1(110.52,78.75) 110.27,79.01 97.31,79.01 NOREF#13.3 97.06,77.83 NOREF#32.3 75.03,65.28 NOREF#28.3
  Bottom Layer w0.254: v1(110.52,78.75) 111.28,79.51 114.84,79.51 116.36,77.99 128.81,77.99 132.65,74.15 U1.32
CI_LEFT: length 103.4
  Top Layer w0.254: v1(85.54,70.68) 85.28,70.42 v1(80.2,70.42)
  Bottom Layer w0.254: v1(85.54,70.68) 87.31,70.68 92.39,65.6 92.39,64.33 93.92,62.8 ; 93.92,62.8 93.92,61.3 92.68,60.06 ; 93.92,62.8 135.77,62.8 136.03,63.06 136.03,77.53 134.33,79.23 U1.34 ; 92.68,60.06 NOREF#3.3 ; 92.68,60.06 94.2,58.54 94.2,53.82 NOREF#21.3 ; v1(80.2,70.42) 78.68,70.42 70.8,78.3 NOREF#6.3
CI_RIGHT: length 79
  Top Layer w0.254: v1(94.04,63.56) 75.06,63.56 NOREF#22.3 71.64,51.94 NOREF#35.3
  Bottom Layer w0.254: NOREF#11.3 116.64,69.4 115.62,68.39 115.62,67.12 ; 115.62,67.12 97.59,67.12 v1(94.04,63.56) ; 115.62,67.12 116.13,66.61 122.23,66.61 127.23,71.61 U1.31
DOWN: length 61.3
  Top Layer w0.254: v1(106.98,84.15) v1(111.3,84.15)
  Bottom Layer w0.254: U6.1 97.07,84.15 v1(106.98,84.15) ; v1(111.3,84.15) 111.46,84.31 131.02,84.31 132.28,85.58 144.22,85.58 145.75,84.06 153.92,84.06 U1.5
GUDING1: length 15.4
  Bottom Layer w0.254: NOREF#33.1 NOREF#40.1
HOME: length 181.5
  Top Layer w0.254: v1(133.23,60.18) 133.23,63.23 118.25,78.22 116.72,78.22 115.2,79.74 115.2,83.3 106.37,92.13 7.24,92.13 NOREF#43.1 ; v1(152.34,52.62) v1(150.82,54.15)
  Bottom Layer w0.254: v1(150.82,54.15) 150.82,55.92 148.03,58.72 134.19,58.72 U1.26 134,59.42 v1(133.23,60.18) ; v1(152.34,52.62) 158.95,52.62 U6#7.1
L3: length 36.8
  Top Layer w0.254: v1(120.24,34.59) 133.44,47.8 v1(133.44,52.62)
  Bottom Layer w0.254: v1(133.44,52.62) 133.44,53.28 U1.24 ; U6#3.1 v1(120.24,34.59)
LB: length 129.1
  Top Layer w0.254: v1(208.58,83.77) 204.01,83.77 202.48,85.3 181.82,85.3 176.49,79.96 173.95,79.96 155.66,61.67 v1(155.66,55.07)
  Bottom Layer w0.254: v1(208.58,83.77) 224.33,83.77 226.11,85.55 228.39,85.55 229.41,84.53 245.92,84.53 248.71,87.33 257.35,87.33 261.67,83.01 ; U1.17 155.41,55.07 v1(155.66,55.07)
LED1: length 297.9
  Top Layer w0.254: NOREF#14.2 234.63,16.05 161.48,16.05 159.96,17.58 149.54,17.58 NOREF#15.2 134.05,30.53 v1(134.05,65.33) ; v1(30.16,79.32) 30.16,79.07 32.45,76.78 55.82,76.78 NOREF#17.2 68.38,64.22 111.87,64.22 v1(112.41,64.75)
  Bottom Layer w0.254: v1(30.16,79.32) 29.92,79.57 U5#19.4 ; v1(134.05,65.33) 134.05,66.48 U1.29 123.58,66.53 121.8,64.75 v1(112.41,64.75)
LEFT: length 100.6
  Bottom Layer w0.254: U6#18.1 73.2,90.38 93.77,90.38 99.36,84.79 129.08,84.79 132.38,88.09 135.68,88.09 137.46,86.31 147.62,86.31 148.38,85.55 155.75,85.55 156.26,85.04 156.26,80.98 154.51,79.23 U1.7
LT: length 119.5
  Top Layer w0.254: v1(256.84,66.5) v1(169.72,66.5)
  Bottom Layer w0.254: v1(256.84,66.5) 259.13,66.5 U6#14.1 ; U1.12 154.39,66.75 166.67,66.75 166.92,66.5 v1(169.72,66.5)
R3: length 71.6
  Top Layer w0.254: v1(182.01,37.59) 168.29,37.59 v1(149.5,56.39)
  Bottom Layer w0.254: v1(149.5,56.39) 134.01,56.39 U1.25 ; U6#6.1 v1(182.01,37.59)
RB: length 106.9
  Top Layer w0.254: v1(180.89,68.66) 168.7,68.66 v1(167.18,67.14)
  Bottom Layer w0.254: v1(180.89,68.66) 198.67,86.44 203.75,86.44 205.53,88.22 211.37,88.22 212.9,86.69 229.66,86.69 231.44,88.47 233.73,88.47 U6#12.1 ; v1(167.18,67.14) 166.67,67.64 152.45,67.64 152.19,67.39 152.19,57.99 153.81,56.37 U1.16
RIGHT: length 33.7
  Bottom Layer w0.254: U1.6 152.87,80.47 121.33,80.47 U6#2.1
RT: length 94.9
  Top Layer w0.254: v1(166.29,69.04) 166.54,69.29 200.07,69.29 203.12,72.34 228.52,72.34 v1(232.08,68.79)
  Bottom Layer w0.254: v1(166.29,69.04) 154.2,69.04 U1.11 ; v1(232.08,68.79) 233.6,68.79 U6#13.1
SELECT: length 137.8
  Top Layer w0.254: v1(106.8,46.27) 74.29,46.27 72.26,48.31 60.32,48.31 27.3,81.33 NOREF#7.1 25.85,88.77 v1(22.37,88.77)
  Bottom Layer w0.254: U1.21 133.93,46.27 v1(106.8,46.27) ; U6#16.1 v1(22.37,88.77)
START: length 136.3
  Top Layer w0.254: NOREF#2.1 37.9,89.89 v1(37.9,88.77)
  Bottom Layer w0.254: U1.22 134,48.88 132.79,50.09 131.89,50.09 130.11,51.87 108.68,51.87 104.62,47.8 77.25,47.8 71.86,53.2 67.34,53.2 61.25,47.1 61.15,47.1 61.14,47.09 60.66,47.09 60.31,47.43 60.31,47.53 54.25,53.59 54.25,75.94 42.94,87.25 U6#17.1 40.78,89.28 38.41,89.28 v1(37.9,88.77)
UP: length 80.7
  Bottom Layer w0.254: U6#5.1 151.63,34.04 151.63,76.97 152.65,77.98 155.95,77.98 156.71,78.75 156.71,85.35 155.21,86.85 U1.4
X: length 38.6
  Top Layer w0.254: v1(160.83,65.99) 174.29,79.45 177.34,79.45 v1(178.61,78.18)
  Bottom Layer w0.254: U1.14 156.29,61.45 v1(160.83,65.99) ; U6#8.1 181.91,78.18 v1(178.61,78.18)
Y: length 68.4
  Top Layer w0.254: v1(180.64,67.9) 168.96,67.9 167.18,66.12 v1(166.42,66.12)
  Bottom Layer w0.254: U6#10.1 207.82,84.15 204.52,84.15 202.74,85.93 200.2,85.93 182.16,67.9 v1(180.64,67.9) ; v1(166.42,66.12) 160.57,60.28 155.53,60.28 U1.15

## Copper pours and planes (outline as drawn; the poured copper is in the pictures)
GND on Top Layer: -6.67,108.13 301.31,108.13 301.31,-14.55 -6.67,-14.55

## Text on the board
Bottom Layer: 3 | led1 | 8 | led3 | background led | 3.3v | gnd | out | cizhou right | cizhou down | cizhou left | Hitboard Pro v2.4 / Designed by 搅局
Top Silkscreen Layer: SELECT | START
